# EAGLE design TDA7052A mono (EAGLE 6.2)
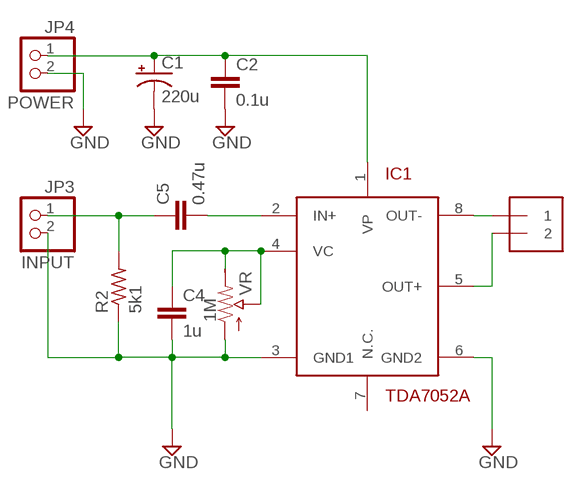
[diagram p0: schematic, sheet 1]

## Parts
C1  220u  CAP_POLPTH1  [CPOL-RADIAL-100UF-25V]
C2  0.1u  CAPPTH2  [CAP-PTH-SMALL2]
C4  1u  CAPPTH2  [CAP-PTH-SMALL2]
C5  0.47u  CAPPTH2  [CAP-PTH-SMALL2]
IC1  TDA7052A  [DIL08]
JP3  INPUT  PINHD-1X2  [1X02]
JP4  POWER  PINHD-1X2  [1X02]
R2  5k1  R-US_0204/5  [0204/5]
SPEAKER  1X2-3.5MM  [1X2-3.5MM]
VR  1M  POT-RV16AF-20  [POT_ALPHA_RV16AF-20]

## Nets
GND: C1.2(-) C2.2 C4.2 IC1.3(GND1) IC1.6(GND2) JP3.2 JP4.2 R2.1 VR.1(A)
N$2: C5.2 IC1.2(IN+)
N$5: C4.1 IC1.4(VC) VR.2(S) VR.3(E)
N$8: IC1.8(OUT-) SPEAKER.1
N$9: IC1.5(OUT+) SPEAKER.2
N$13: C5.1 JP3.1 R2.2
POWER: C1.1(+) C2.1 IC1.1(VP) JP4.1
Unconnected: IC1.7(N.C.)

## Library data of the parts
C1 = SparkFun:CAP_POL: Capacitor Polarized These are standard SMD and PTH capacitors. Normally 10uF, 47uF, and 100uF in electrolytic and tantalum varieties. Always verify the external diameter of the through hole cap, it varies with capacity, voltage, and manufacturer. The EIA devices should be standard.
C2 C4 C5 = SparkFun:CAP: Capacitor Standard 0603 ceramic capacitor, and 0.1" leaded capacitor.
IC1 = My Library:TDA7052A: AUDIO AMPLIFIER
JP3 JP4 = pinhead:PINHD-1X2: PIN HEADER
R2 = adafruit:R-US_: RESISTOR, American symbol
SPEAKER = adafruit:1X2: 3.5mm Terminal block http://www.ladyada.net/library/pcb/eaglelibrary.html
VR = My Library:POT

## Board
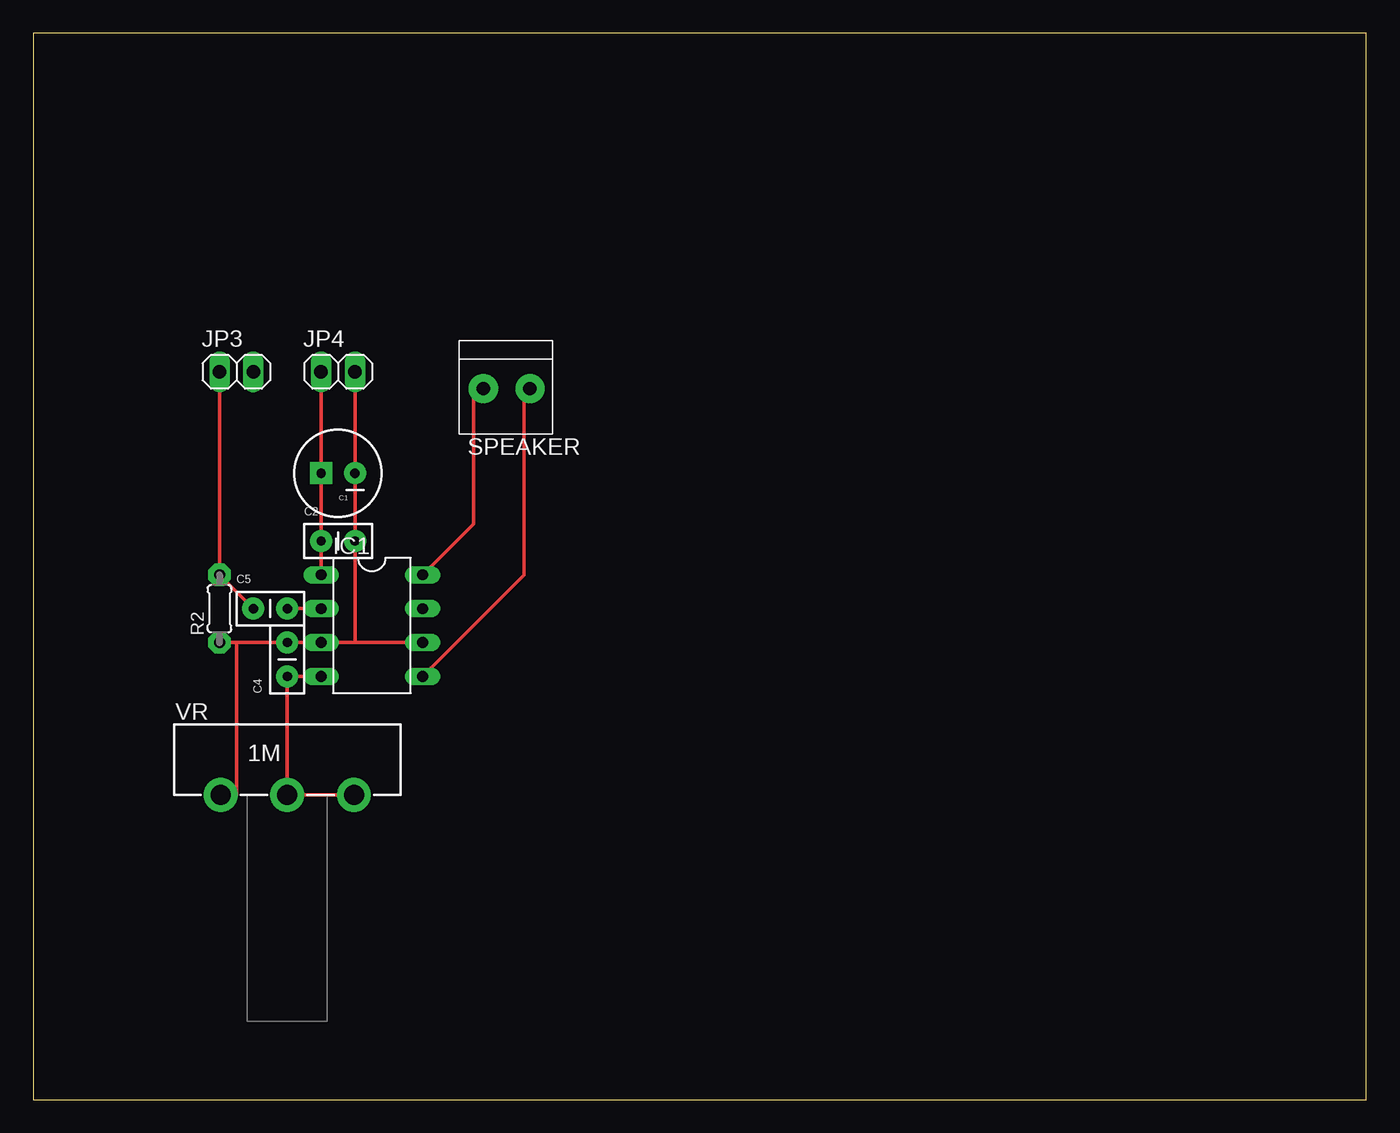
[diagram p1: board, top side]
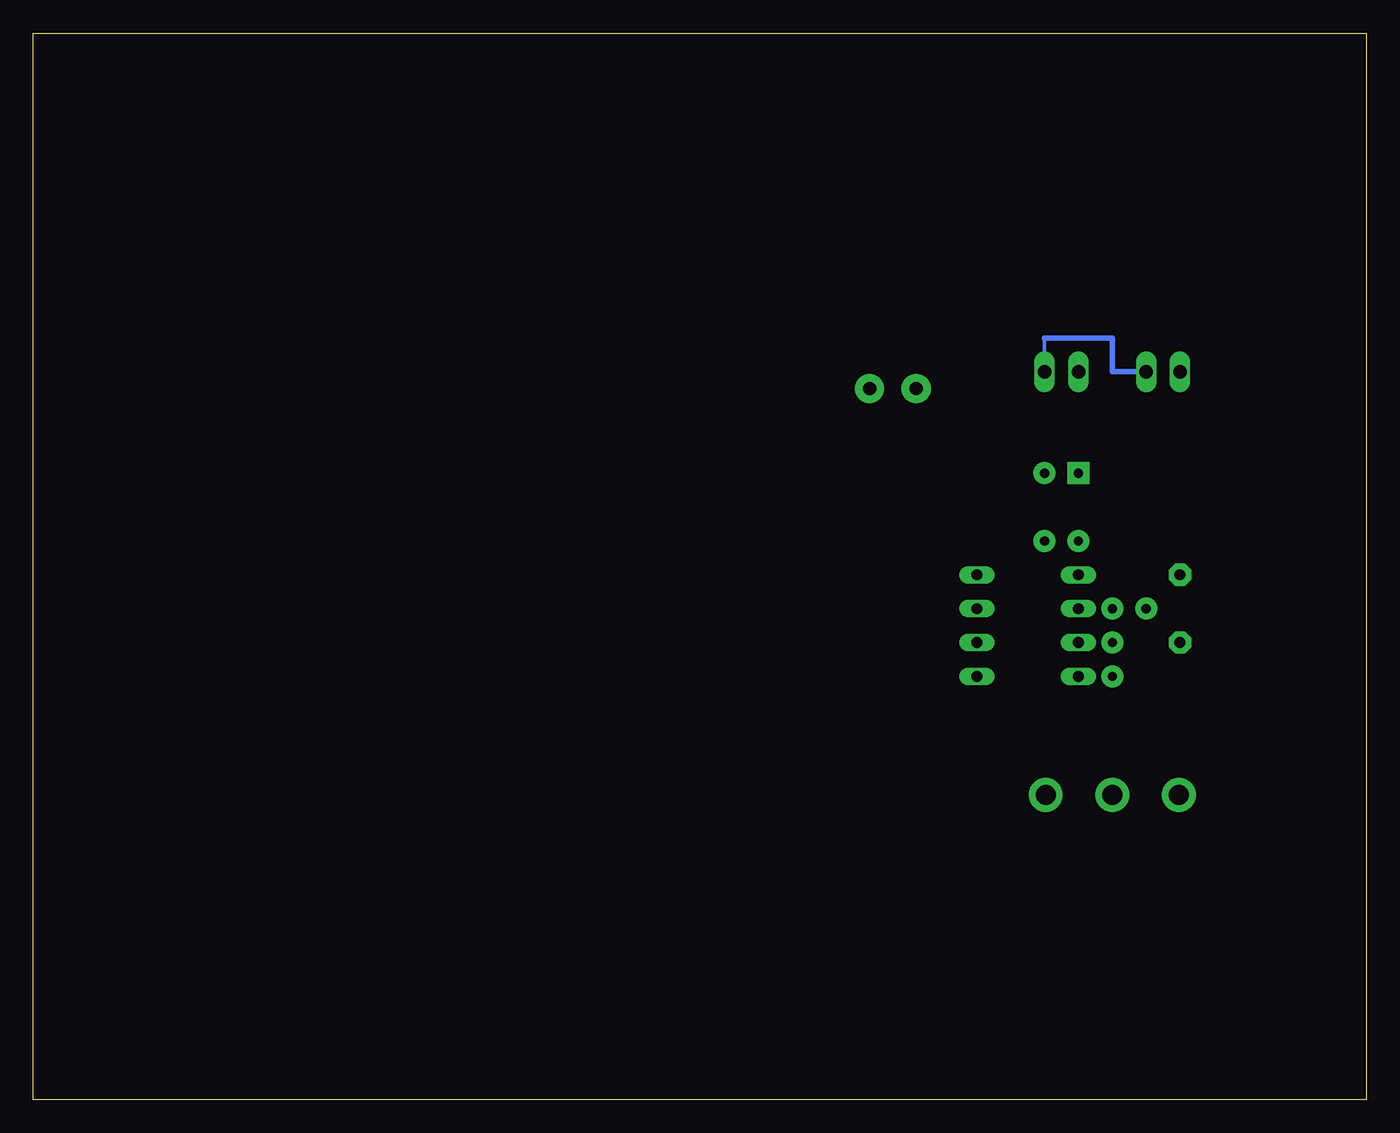
[diagram p2: board, bottom side, seen from below]

Size 100 x 80 mm. Coordinates in mm from the lower left corner, seen from the top.
Outline: 0,0 100,0 100,80 0,80 0,0
Copper layers (1*16): Top 0.035mm / dielectric 1.5mm / Bottom 0.035mm
Design rules: minimum track width 10mil, minimum drill 24mil, track to track 8mil, track to pad 8mil, pad to pad 8mil, via to via 8mil, smd to smd 8mil, copper to edge 40mil, drill to drill 8mil, minimum pad ring 10mil, minimum via ring 8mil, stop-mask expansion 4mil, vias tented up to drill 0mil, thermal gap 10mil

### Footprints (pad centres in the part's own frame; a part is rotated, then mirrored left to right if it is on the bottom)
CPOL-RADIAL-100UF-25V = drill 0.7 pad 1.651 square: 1 1.27,0 | drill 0.7 pad 1.651: 2 -1.27,0
CAP-PTH-SMALL2 = drill 0.7 pad 1.651: 1 0,0; 2 2.54,0
DIL08 = drill 0.813 long: 1 -3.81,-3.81; 2 -1.27,-3.81; 3 1.27,-3.81; 4 3.81,-3.81; 5 3.81,3.81; 6 1.27,3.81; 7 -1.27,3.81; 8 -3.81,3.81
1X02 = drill 1.016 long: 1 -1.27,0; 2 1.27,0
0204/5 = drill 0.813 pad 1.676 octagon: 1 -2.54,0; 2 2.54,0
1X2-3.5MM = drill 1 pad 2.184: 1 1.8,0; 2 -1.7,0
POT_ALPHA_RV16AF-20 = drill 1.5 pad 2.54: 1 -5,0; 2 0,0; 3 5,0

### Placement (x,y rotation side)
C1  22.86,46.99 180 top
C2  21.59,41.91 0 top
C4  19.05,31.75 90 top
C5  16.51,36.83 0 top
IC1  25.4,35.56 270 top
JP3  15.24,54.61 0 top
JP4  22.86,54.61 0 top
R2  13.97,36.83 90 top
SPEAKER  35.56,53.34 180 top
VR  19.05,22.86 0 top

### Tracks (layer width: path | path; a pad name or v marks a point on that pad's centre or on a via)
GND
  Top 0.254: JP4.2 C1.2 C2.2 24.13,34.29 | 24.13,34.29 IC1.3 C4.2 15.24,34.29 | 24.13,34.29 IC1.6 | 15.24,34.29 R2.1 | 15.24,34.29 15.24,22.86 VR.1
  Bottom 0.254: 24.13,57.15 JP4.2
  Bottom 0.406: JP3.2 19.05,54.61 19.05,57.15 24.13,57.15
N$2
  Top 0.254: C5.2 IC1.2
N$5
  Top 0.254: IC1.4 C4.1 VR.2 20.32,22.86 VR.3
N$8
  Top 0.254: IC1.8 33.02,43.18 33.02,53.34 SPEAKER.1
N$9
  Top 0.254: IC1.5 36.83,39.37 36.83,53.34 SPEAKER.2
N$13
  Top 0.254: JP3.1 R2.2 C5.1
POWER
  Top 0.254: IC1.1 C2.1 C1.1 JP4.1